# Altium schematic sheet Public UART.schdoc
size 244 x 110 mm
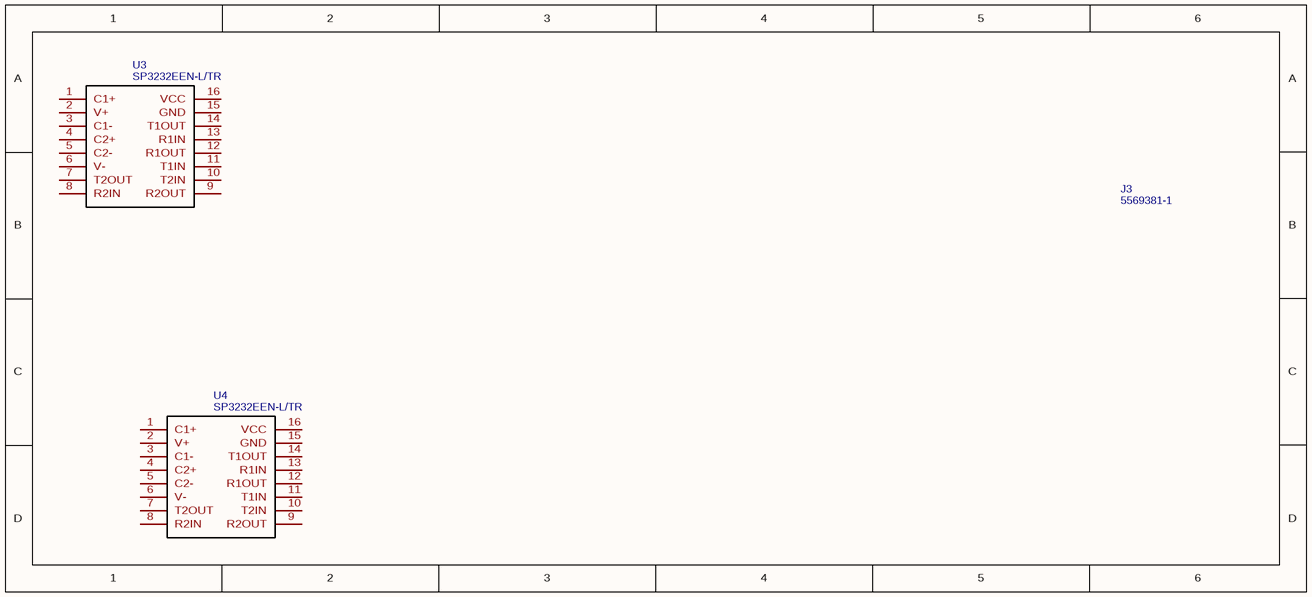
[diagram p0: Public UART.schdoc]

## Parts
J3  5569381-1  [55693811]
U3  SP3232EEN-L/TR  [SOIC-16_L9.9-W3.9-P1.27-LS6.0-BL]
U4  SP3232EEN-L/TR  [SOIC-16_L9.9-W3.9-P1.27-LS6.0-BL]

## Nets

Not connected (* = marked no-connect by the designer): U3 1(C1+) 2(V+) 3(C1-) 4(C2+) 5(C2-) 6(V-) 7(T2OUT) 8(R2IN) 9(R2OUT) 10(T2IN) 11(T1IN) 12(R1OUT) 13(R1IN) 14(T1OUT) 15(GND) 16(VCC); U4 1(C1+) 2(V+) 3(C1-) 4(C2+) 5(C2-) 6(V-) 7(T2OUT) 8(R2IN) 9(R2OUT) 10(T2IN) 11(T1IN) 12(R1OUT) 13(R1IN) 14(T1OUT) 15(GND) 16(VCC)

## Library data of the parts
J3 = 5569381-1: Contributor: Ke'Ondrae_Mell; spicePre: J; spiceSymbolName: 5569381-1
U3 U4 = SP3232EEN-L/TR: BOM_Manufacturer: EXAR; SMT Type: Extend; BOM_Supplier: LCSC; BOM_Manufacturer Part: SP3232EEN-L/TR; image: //image.lceda.cn/szlcsc/C9378.jpg; BOM_Supplier Part: C9378; BOM_LCSC Assembly: Yes; spicePre: U; spiceSymbolName: SP3232EEN-L/TR